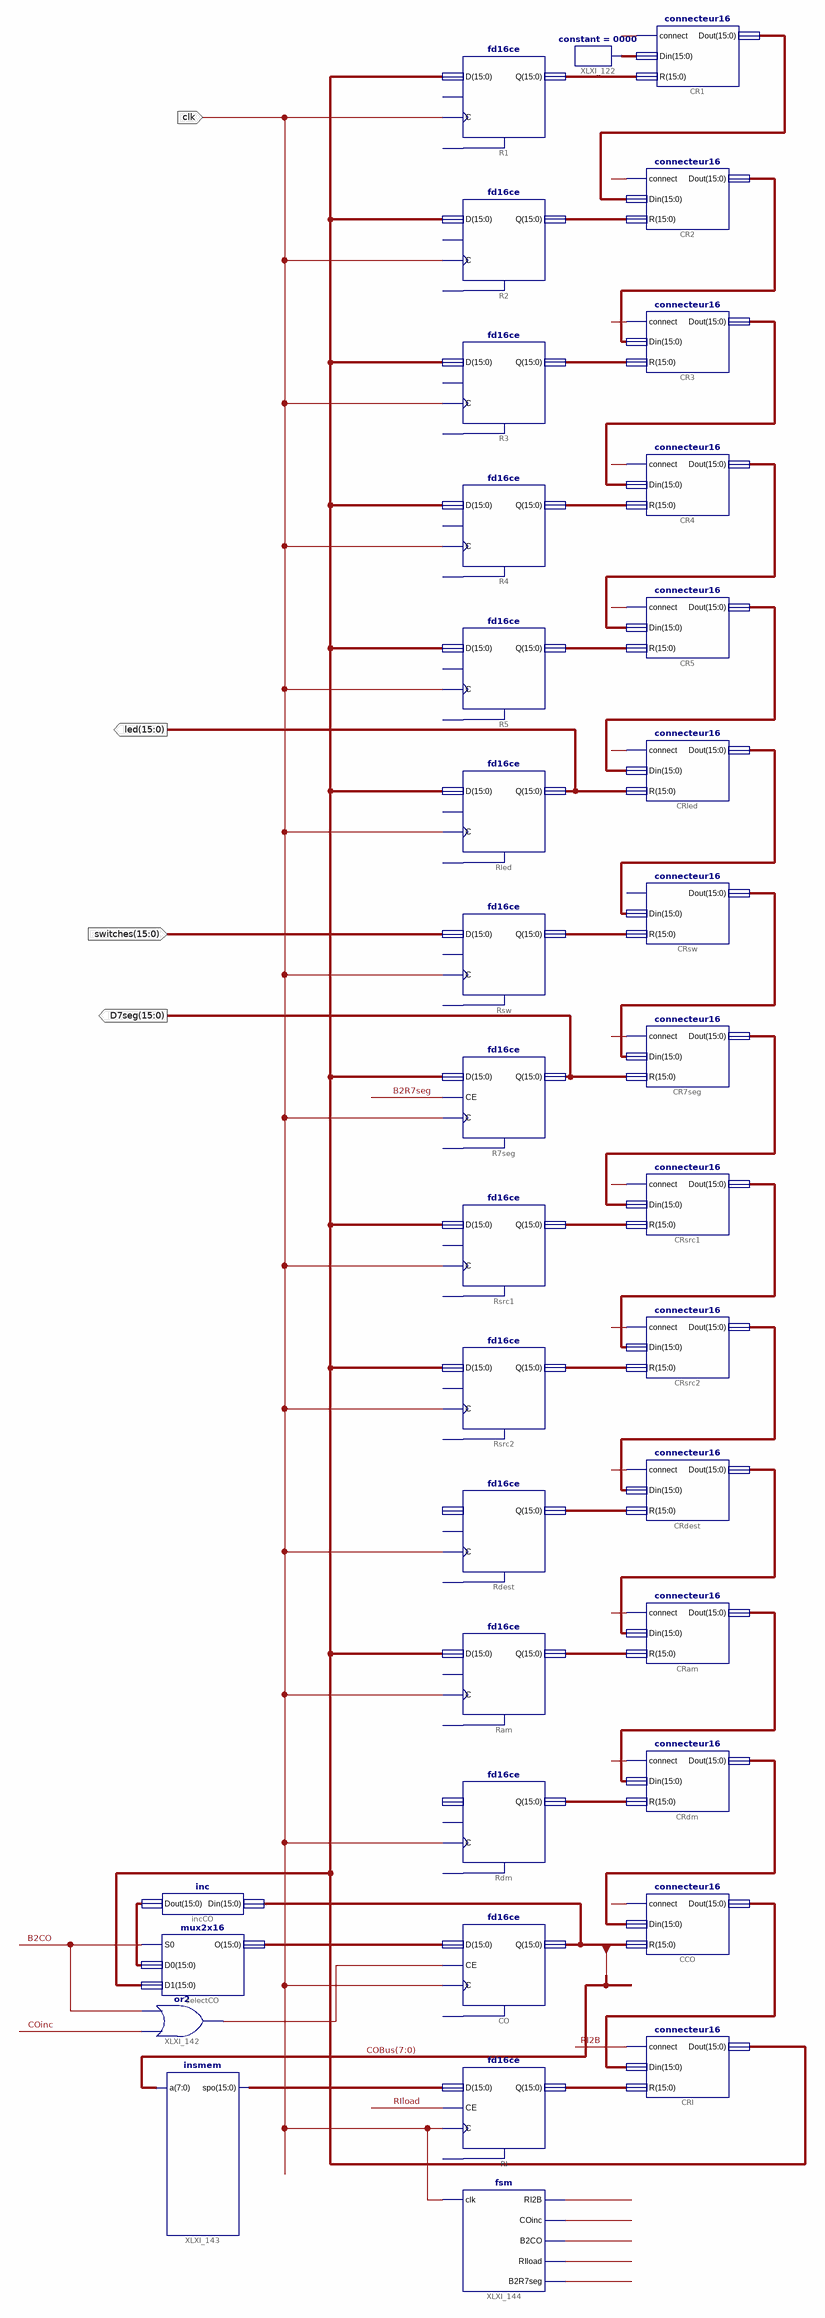
[diagram p0: schematic sheet 1]
// Xilinx ISE schematic S3.sch (spartan3e) as structural Verilog: 36 symbols, 4 ports
module S3 (
  input  clk,
  input  [15:0] switches,
  output [15:0] led,
  output [15:0] D7seg
);

  wire B2CO, B2R7seg, COinc, RI2B, RIload, XLXN_18, XLXN_19, XLXN_20, XLXN_21, XLXN_22, XLXN_23, XLXN_25,
       XLXN_26, XLXN_27, XLXN_28, XLXN_29, XLXN_30, XLXN_31, XLXN_52;
  wire [15:0] COBus, XLXN_1, XLXN_2, XLXN_3, XLXN_4, XLXN_5, XLXN_7, XLXN_9, XLXN_10, XLXN_11, XLXN_12,
       XLXN_13, XLXN_15, XLXN_17, XLXN_33, XLXN_34, XLXN_35, XLXN_36, XLXN_37, XLXN_38, XLXN_39, XLXN_40,
       XLXN_41, XLXN_42, XLXN_43, XLXN_44, XLXN_45, XLXN_46, XLXN_47, XLXN_49, XLXN_53, XLXN_57;

  fd16ce R1 (.C(clk), .D(XLXN_47), .Q(XLXN_1));  // open: CE, CLR
  fd16ce R2 (.C(clk), .D(XLXN_47), .Q(XLXN_2));  // open: CE, CLR
  fd16ce R3 (.C(clk), .D(XLXN_47), .Q(XLXN_3));  // open: CE, CLR
  fd16ce R4 (.C(clk), .D(XLXN_47), .Q(XLXN_4));  // open: CE, CLR
  fd16ce R5 (.C(clk), .D(XLXN_47), .Q(XLXN_5));  // open: CE, CLR
  fd16ce Rled (.C(clk), .D(XLXN_47), .Q(led));  // open: CE, CLR
  fd16ce Rsw (.C(clk), .D(switches), .Q(XLXN_7));  // open: CE, CLR
  fd16ce R7seg (.C(clk), .CE(B2R7seg), .D(XLXN_47), .Q(D7seg));  // open: CLR
  fd16ce Rsrc1 (.C(clk), .D(XLXN_47), .Q(XLXN_9));  // open: CE, CLR
  fd16ce Rsrc2 (.C(clk), .D(XLXN_47), .Q(XLXN_10));  // open: CE, CLR
  fd16ce Rdest (.C(clk), .Q(XLXN_11));  // open: CE, CLR, D
  fd16ce Ram (.C(clk), .D(XLXN_47), .Q(XLXN_12));  // open: CE, CLR
  fd16ce Rdm (.C(clk), .Q(XLXN_13));  // open: CE, CLR, D
  fd16ce CO (.C(clk), .CE(XLXN_52), .D(XLXN_53), .Q(COBus));  // open: CLR
  fd16ce RI (.C(clk), .CE(RIload), .D(XLXN_57), .Q(XLXN_15));  // open: CLR
  connecteur16 CR1 (.connect(XLXN_18), .Din(XLXN_17), .R(XLXN_1), .Dout(XLXN_33));
  connecteur16 CR2 (.connect(XLXN_19), .Din(XLXN_33), .R(XLXN_2), .Dout(XLXN_34));
  connecteur16 CR3 (.connect(XLXN_20), .Din(XLXN_34), .R(XLXN_3), .Dout(XLXN_35));
  connecteur16 CR4 (.connect(XLXN_21), .Din(XLXN_35), .R(XLXN_4), .Dout(XLXN_36));
  connecteur16 CR5 (.connect(XLXN_22), .Din(XLXN_36), .R(XLXN_5), .Dout(XLXN_37));
  connecteur16 CRled (.connect(XLXN_23), .Din(XLXN_37), .R(led), .Dout(XLXN_38));
  connecteur16 CRsw (.Din(XLXN_38), .R(XLXN_7), .Dout(XLXN_39));  // open: connect
  connecteur16 CR7seg (.connect(XLXN_25), .Din(XLXN_39), .R(D7seg), .Dout(XLXN_40));
  connecteur16 CRsrc1 (.connect(XLXN_26), .Din(XLXN_40), .R(XLXN_9), .Dout(XLXN_41));
  connecteur16 CRsrc2 (.connect(XLXN_27), .Din(XLXN_41), .R(XLXN_10), .Dout(XLXN_42));
  connecteur16 CRdest (.connect(XLXN_28), .Din(XLXN_42), .R(XLXN_11), .Dout(XLXN_43));
  connecteur16 CRam (.connect(XLXN_29), .Din(XLXN_43), .R(XLXN_12), .Dout(XLXN_44));
  connecteur16 CRdm (.connect(XLXN_30), .Din(XLXN_44), .R(XLXN_13), .Dout(XLXN_45));
  connecteur16 CCO (.connect(XLXN_31), .Din(XLXN_45), .R(COBus), .Dout(XLXN_46));
  connecteur16 CRI (.connect(RI2B), .Din(XLXN_46), .R(XLXN_15), .Dout(XLXN_47));
  constant #(.CValue("0000")) XLXI_122 (.O(XLXN_17));
  inc incCO (.Din(COBus), .Dout(XLXN_49));
  mux2x16 selectCO (.S0(B2CO), .D0(XLXN_49), .D1(XLXN_47), .O(XLXN_53));
  or XLXI_142 (XLXN_52, COinc, B2CO);
  insmem XLXI_143 (.a(COBus[7:0]), .spo(XLXN_57));
  fsm XLXI_144 (.clk(clk), .RI2B(RI2B), .COinc(COinc), .B2CO(B2CO), .RIload(RIload), .B2R7seg(B2R7seg));
endmodule
